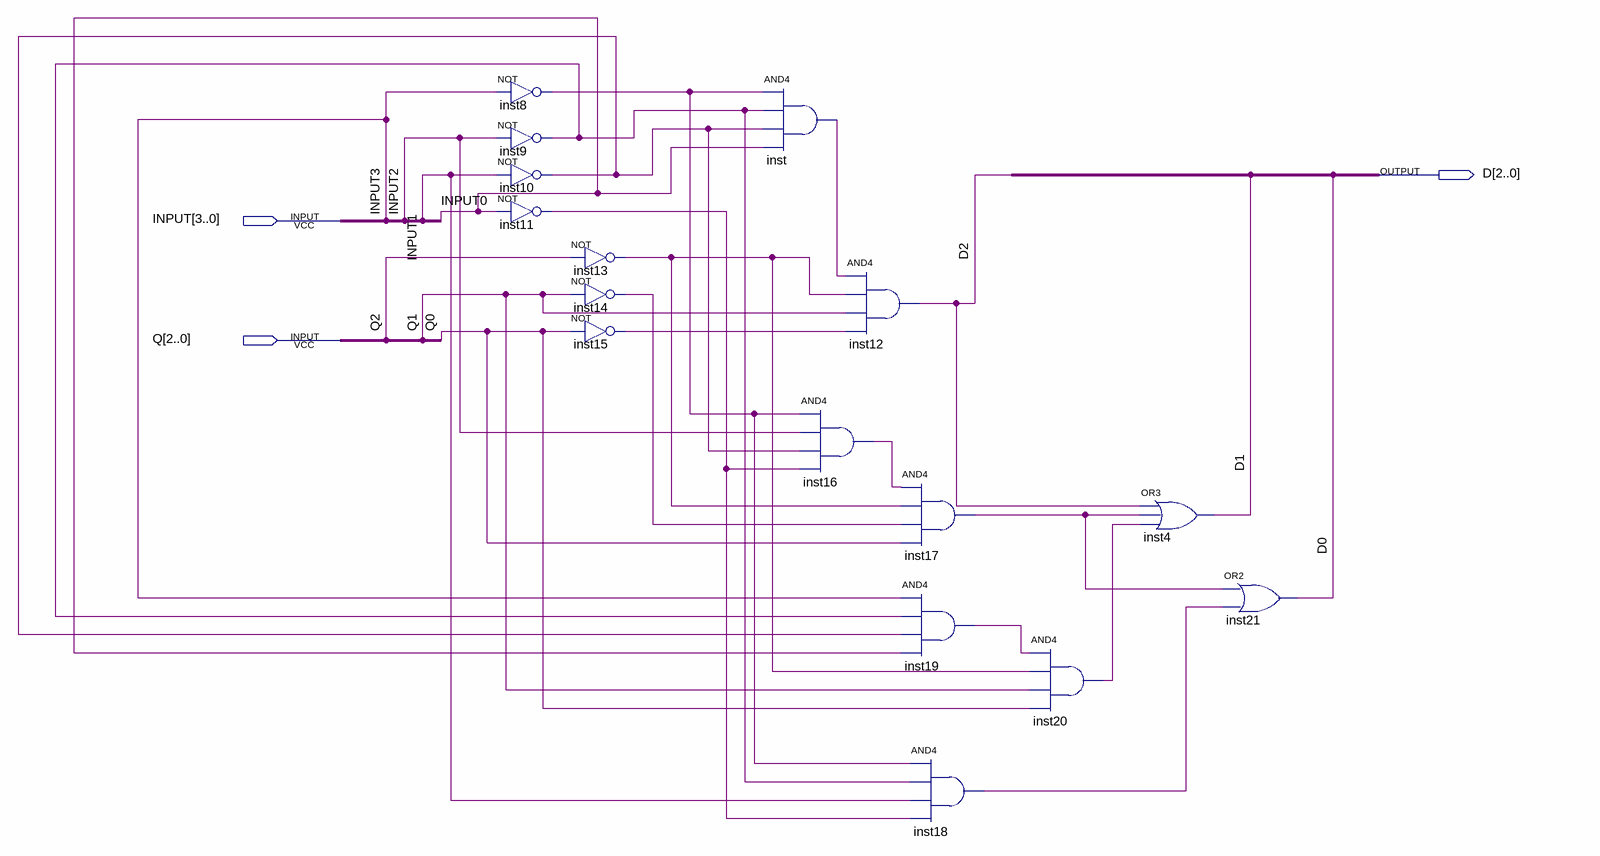
[diagram p0: schematic sheet]
// Quartus schematic NextStateConverter.bdf as structural Verilog: 16 symbols, 3 pins
module NextStateConverter (
  input  [3:0] INPUT,
  input  [2:0] Q,
  output [2:0] D
);

  wire inst8_out, inst9_out, inst10_out, inst11_out, inst13_out, inst14_out, inst15_out, inst16_out,
       inst17_out, inst18_out, inst19_out, inst20_out, inst_out;

  not inst8 (inst8_out, INPUT[3]);
  not inst9 (inst9_out, INPUT[2]);
  not inst10 (inst10_out, INPUT[1]);
  not inst11 (inst11_out, INPUT[0]);
  not inst13 (inst13_out, Q[2]);
  not inst14 (inst14_out, Q[1]);
  not inst15 (inst15_out, Q[0]);
  and inst (inst_out, inst8_out, inst9_out, inst10_out, INPUT[0]);
  and inst12 (D[2], inst_out, inst13_out, Q[1], inst15_out);
  and inst16 (inst16_out, inst8_out, INPUT[2], inst10_out, inst11_out);
  and inst17 (inst17_out, inst16_out, inst13_out, inst14_out, Q[0]);
  and inst19 (inst19_out, INPUT[3], inst9_out, inst10_out, INPUT[0]);
  and inst18 (inst18_out, inst8_out, inst9_out, INPUT[1], inst11_out);
  and inst20 (inst20_out, inst19_out, inst13_out, Q[1], Q[0]);
  or inst4 (D[1], D[2], inst17_out, inst20_out);
  or inst21 (D[0], inst17_out, inst18_out);
endmodule
